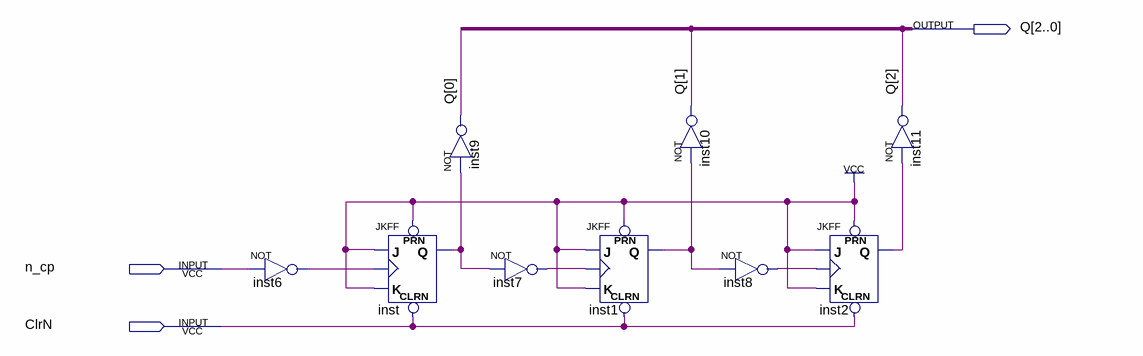
[diagram p0: schematic sheet]
// Quartus schematic 3bit_ripple_down.bdf as structural Verilog: 9 symbols, 3 pins
module \3bit_ripple_down  (
  input  n_cp,
  input  ClrN,
  output [2:0] Q
);

  wire inst1_q, inst2_q, inst6_out, inst7_out, inst8_out, inst_q;

  not inst6 (inst6_out, n_cp);
  JKFF inst (.PRN(1'b1), .CLRN(ClrN), .K(1'b1), .J(1'b1), .CLK(inst6_out), .Q(inst_q));
  not inst9 (Q[0], inst_q);
  not inst7 (inst7_out, inst_q);
  JKFF inst1 (.PRN(1'b1), .CLRN(ClrN), .K(1'b1), .J(1'b1), .CLK(inst7_out), .Q(inst1_q));
  not inst10 (Q[1], inst1_q);
  not inst8 (inst8_out, inst1_q);
  not inst11 (Q[2], inst2_q);
  JKFF inst2 (.PRN(1'b1), .CLRN(ClrN), .K(1'b1), .J(1'b1), .CLK(inst8_out), .Q(inst2_q));
endmodule
